# Altium project WordClockLedBoard.PrjPcb
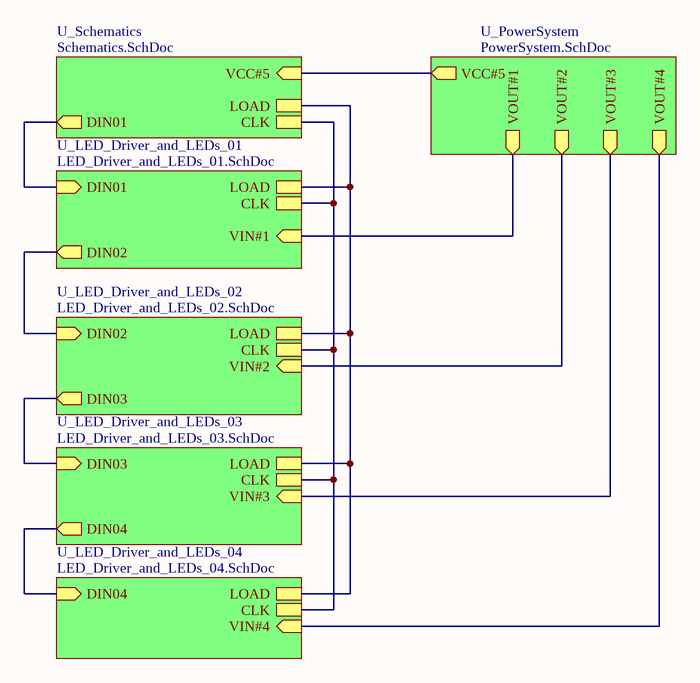
[diagram p0: MasterSheet.SchDoc]
4 sheets, 204 parts. Net scope: hierarchical (ports join the sheet entries above them; power ports are global).
Board file: NonRGB-v1.PcbDoc
Sheets:
  MasterSheet.SchDoc
    U_LED_Driver_and_LEDs_01 = LED_Driver_and_LEDs_01.SchDoc
    U_LED_Driver_and_LEDs_02 = LED_Driver_and_LEDs_02.SchDoc
    U_LED_Driver_and_LEDs_04 = LED_Driver_and_LEDs_04.SchDoc

## Sheet MasterSheet.SchDoc
size A

### Sub-sheets
U_LED_Driver_and_LEDs_01 = LED_Driver_and_LEDs_01.SchDoc: VIN#1 (in), DIN02 (out), DIN01 (in), LOAD, CLK
U_LED_Driver_and_LEDs_02 = LED_Driver_and_LEDs_02.SchDoc: VIN#2 (in), DIN02 (in), DIN03 (out), LOAD, CLK
U_LED_Driver_and_LEDs_03 = LED_Driver_and_LEDs_03.SchDoc (file not in this document): VIN#3 (in), DIN03 (in), DIN04 (out), LOAD, CLK
U_LED_Driver_and_LEDs_04 = LED_Driver_and_LEDs_04.SchDoc: VIN#4 (in), DIN04 (in), LOAD, CLK
U_PowerSystem = PowerSystem.SchDoc (file not in this document): VOUT#2 (out), VOUT#3 (out), VOUT#4 (out), VOUT#1 (out), VCC#5 (out)
U_Schematics = Schematics.SchDoc (file not in this document): DIN01 (out), VCC#5 (in), CLK, LOAD

### Nets
CLK: sheet U_LED_Driver_and_LEDs_01/CLK, sheet U_LED_Driver_and_LEDs_02/CLK, sheet U_LED_Driver_and_LEDs_03/CLK, sheet U_LED_Driver_and_LEDs_04/CLK, sheet U_Schematics/CLK
LOAD: sheet U_LED_Driver_and_LEDs_01/LOAD, sheet U_LED_Driver_and_LEDs_02/LOAD, sheet U_LED_Driver_and_LEDs_03/LOAD, sheet U_LED_Driver_and_LEDs_04/LOAD, sheet U_Schematics/LOAD
VCC#1: sheet U_PowerSystem/VOUT#1, sheet U_LED_Driver_and_LEDs_01/VIN#1
NetC15_1: sheet U_PowerSystem/VOUT#2, sheet U_LED_Driver_and_LEDs_02/VIN#2
NetC19_1: sheet U_PowerSystem/VOUT#4, sheet U_LED_Driver_and_LEDs_04/VIN#4
NetMAX1_1: sheet U_LED_Driver_and_LEDs_01/DIN01, sheet U_Schematics/DIN01
NetMAX1_24: sheet U_LED_Driver_and_LEDs_01/DIN02, sheet U_LED_Driver_and_LEDs_02/DIN02
NetMAX2_24: sheet U_LED_Driver_and_LEDs_02/DIN03, sheet U_LED_Driver_and_LEDs_03/DIN03
NetMAX4_1: sheet U_LED_Driver_and_LEDs_03/DIN04, sheet U_LED_Driver_and_LEDs_04/DIN04
(unnamed): sheet U_PowerSystem/VOUT#3, sheet U_LED_Driver_and_LEDs_03/VIN#3
(unnamed): sheet U_PowerSystem/VCC#5, sheet U_Schematics/VCC#5

## Sheet LED_Driver_and_LEDs_01.SchDoc
size A
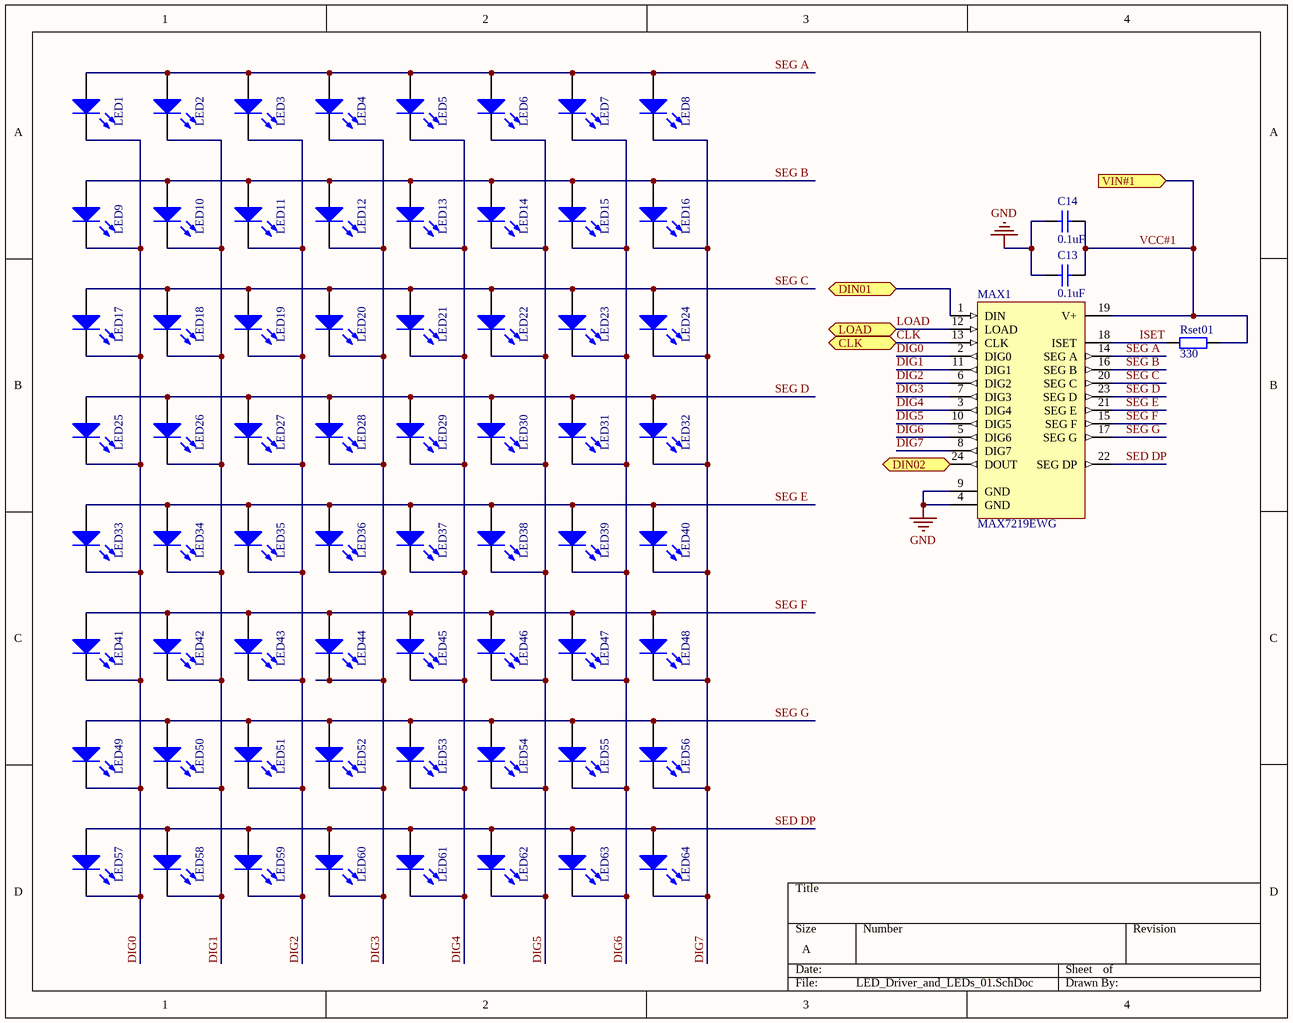
[diagram p1: LED_Driver_and_LEDs_01.SchDoc]

### Parts
C13  value 0.1uF  [6-0805_N]  (hidden comment: Cap Semi)
C14  value 0.1uF  [6-0805_N]  (hidden comment: Cap Semi)
LED1  LED3  [3.5X2.8X1.9]  (value not drawn)
LED2  LED3  [3.5X2.8X1.9]  (value not drawn)
LED3  LED3  [3.5X2.8X1.9]  (value not drawn)
LED4  LED3  [3.5X2.8X1.9]  (value not drawn)
LED5  LED3  [3.5X2.8X1.9]  (value not drawn)
LED6  LED3  [3.5X2.8X1.9]  (value not drawn)
LED7  LED3  [3.5X2.8X1.9]  (value not drawn)
LED8  LED3  [3.5X2.8X1.9]  (value not drawn)
LED9  LED3  [3.5X2.8X1.9]  (value not drawn)
LED10  LED3  [3.5X2.8X1.9]  (value not drawn)
LED11  LED3  [3.5X2.8X1.9]  (value not drawn)
LED12  LED3  [3.5X2.8X1.9]  (value not drawn)
LED13  LED3  [3.5X2.8X1.9]  (value not drawn)
LED14  LED3  [3.5X2.8X1.9]  (value not drawn)
LED15  LED3  [3.5X2.8X1.9]  (value not drawn)
LED16  LED3  [3.5X2.8X1.9]  (value not drawn)
LED17  LED3  [3.5X2.8X1.9]  (value not drawn)
LED18  LED3  [3.5X2.8X1.9]  (value not drawn)
LED19  LED3  [3.5X2.8X1.9]  (value not drawn)
LED20  LED3  [3.5X2.8X1.9]  (value not drawn)
LED21  LED3  [3.5X2.8X1.9]  (value not drawn)
LED22  LED3  [3.5X2.8X1.9]  (value not drawn)
LED23  LED3  [3.5X2.8X1.9]  (value not drawn)
LED24  LED3  [3.5X2.8X1.9]  (value not drawn)
LED25  LED3  [3.5X2.8X1.9]  (value not drawn)
LED26  LED3  [3.5X2.8X1.9]  (value not drawn)
LED27  LED3  [3.5X2.8X1.9]  (value not drawn)
LED28  LED3  [3.5X2.8X1.9]  (value not drawn)
LED29  LED3  [3.5X2.8X1.9]  (value not drawn)
LED30  LED3  [3.5X2.8X1.9]  (value not drawn)
LED31  LED3  [3.5X2.8X1.9]  (value not drawn)
LED32  LED3  [3.5X2.8X1.9]  (value not drawn)
LED33  LED3  [3.5X2.8X1.9]  (value not drawn)
LED34  LED3  [3.5X2.8X1.9]  (value not drawn)
LED35  LED3  [3.5X2.8X1.9]  (value not drawn)
LED36  LED3  [3.5X2.8X1.9]  (value not drawn)
LED37  LED3  [3.5X2.8X1.9]  (value not drawn)
LED38  LED3  [3.5X2.8X1.9]  (value not drawn)
LED39  LED3  [3.5X2.8X1.9]  (value not drawn)
LED40  LED3  [3.5X2.8X1.9]  (value not drawn)
LED41  LED3  [3.5X2.8X1.9]  (value not drawn)
LED42  LED3  [3.5X2.8X1.9]  (value not drawn)
LED43  LED3  [3.5X2.8X1.9]  (value not drawn)
LED44  LED3  [3.5X2.8X1.9]  (value not drawn)
LED45  LED3  [3.5X2.8X1.9]  (value not drawn)
LED46  LED3  [3.5X2.8X1.9]  (value not drawn)
LED47  LED3  [3.5X2.8X1.9]  (value not drawn)
LED48  LED3  [3.5X2.8X1.9]  (value not drawn)
LED49  LED3  [3.5X2.8X1.9]  (value not drawn)
LED50  LED3  [3.5X2.8X1.9]  (value not drawn)
LED51  LED3  [3.5X2.8X1.9]  (value not drawn)
LED52  LED3  [3.5X2.8X1.9]  (value not drawn)
LED53  LED3  [3.5X2.8X1.9]  (value not drawn)
LED54  LED3  [3.5X2.8X1.9]  (value not drawn)
LED55  LED3  [3.5X2.8X1.9]  (value not drawn)
LED56  LED3  [3.5X2.8X1.9]  (value not drawn)
LED57  LED3  [3.5X2.8X1.9]  (value not drawn)
LED58  LED3  [3.5X2.8X1.9]  (value not drawn)
LED59  LED3  [3.5X2.8X1.9]  (value not drawn)
LED60  LED3  [3.5X2.8X1.9]  (value not drawn)
LED61  LED3  [3.5X2.8X1.9]  (value not drawn)
LED62  LED3  [3.5X2.8X1.9]  (value not drawn)
LED63  LED3  [3.5X2.8X1.9]  (value not drawn)
LED64  LED3  [3.5X2.8X1.9]  (value not drawn)
MAX1  MAX7219EWG  [WSO24_N]
Rset01  value 330  [J1-0603]  (hidden comment: Res2)

### Ports
CLK (bidir), DIN01 (bidir), DIN02 (out), LOAD (bidir), VIN#1 (in)

### Nets
GND: C13.2 C14.2 MAX1.4(GND) MAX1.9(GND)
CLK: MAX1.13(CLK) ; port CLK
DIG0: LED1.2(K) LED9.2(K) LED17.2(K) LED25.2(K) LED33.2(K) LED41.2(K) LED49.2(K) LED57.2(K) MAX1.2(DIG0)
DIG1: LED2.2(K) LED10.2(K) LED18.2(K) LED26.2(K) LED34.2(K) LED42.2(K) LED50.2(K) LED58.2(K) MAX1.11(DIG1)
DIG2: LED3.2(K) LED11.2(K) LED19.2(K) LED27.2(K) LED35.2(K) LED43.2(K) LED51.2(K) LED59.2(K) MAX1.6(DIG2)
DIG3: LED4.2(K) LED12.2(K) LED20.2(K) LED28.2(K) LED36.2(K) LED44.2(K) LED52.2(K) LED60.2(K) MAX1.7(DIG3)
DIG4: LED5.2(K) LED13.2(K) LED21.2(K) LED29.2(K) LED37.2(K) LED45.2(K) LED53.2(K) LED61.2(K) MAX1.3(DIG4)
DIG5: LED6.2(K) LED14.2(K) LED22.2(K) LED30.2(K) LED38.2(K) LED46.2(K) LED54.2(K) LED62.2(K) MAX1.10(DIG5)
DIG6: LED7.2(K) LED15.2(K) LED23.2(K) LED31.2(K) LED39.2(K) LED47.2(K) LED55.2(K) LED63.2(K) MAX1.5(DIG6)
DIG7: LED8.2(K) LED16.2(K) LED24.2(K) LED32.2(K) LED40.2(K) LED48.2(K) LED56.2(K) LED64.2(K) MAX1.8(DIG7)
ISET: MAX1.18(ISET) Rset01.2
LOAD: MAX1.12(LOAD) ; port LOAD
SED DP: LED57.1(A) LED58.1(A) LED59.1(A) LED60.1(A) LED61.1(A) LED62.1(A) LED63.1(A) LED64.1(A) MAX1.22(SEG_DP)
SEG A: LED1.1(A) LED2.1(A) LED3.1(A) LED4.1(A) LED5.1(A) LED6.1(A) LED7.1(A) LED8.1(A) MAX1.14(SEG_A)
SEG B: LED9.1(A) LED10.1(A) LED11.1(A) LED12.1(A) LED13.1(A) LED14.1(A) LED15.1(A) LED16.1(A) MAX1.16(SEG_B)
SEG C: LED17.1(A) LED18.1(A) LED19.1(A) LED20.1(A) LED21.1(A) LED22.1(A) LED23.1(A) LED24.1(A) MAX1.20(SEG_C)
SEG D: LED25.1(A) LED26.1(A) LED27.1(A) LED28.1(A) LED29.1(A) LED30.1(A) LED31.1(A) LED32.1(A) MAX1.23(SEG_D)
SEG E: LED33.1(A) LED34.1(A) LED35.1(A) LED36.1(A) LED37.1(A) LED38.1(A) LED39.1(A) LED40.1(A) MAX1.21(SEG_E)
SEG F: LED41.1(A) LED42.1(A) LED43.1(A) LED44.1(A) LED45.1(A) LED46.1(A) LED47.1(A) LED48.1(A) MAX1.15(SEG_F)
SEG G: LED49.1(A) LED50.1(A) LED51.1(A) LED52.1(A) LED53.1(A) LED54.1(A) LED55.1(A) LED56.1(A) MAX1.17(SEG_G)
VCC#1: C13.1 C14.1 MAX1.19(V+) Rset01.1 ; port VIN#1
NetMAX1_1: MAX1.1(DIN) ; port DIN01
NetMAX1_24: MAX1.24(DOUT) ; port DIN02

### Library data of the parts
C13 C14 = Cap Semi: Capacitor (Semiconductor SIM Model); Published: 8-Jun-2000; LatestRevisionDate: 29-May-2009; LatestRevisionNote: IPC-7351 Footprint Added.; PackageReference: C1206; Publisher: Altium Limited; PackageDescription: Chip Capacitor
LED1-LED64 = LED3: Typical BLUE SiC LED; Published: 8-Jun-2000; LatestRevisionDate: 17-Dec-2003; LatestRevisionNote: PCB Footprint replaced.; DatasheetVersion: 16-Apr-2002; PackageVersion: 16-Apr-2002; PackageReference: 3.5X2.8X1.9; Publisher: Altium Limited; PackageDescription: SM LED; 2 C-Bend Leads; Body 3.5 x 2.8 x 1.9 mm, inc leads (LxWxH typ)
MAX1 = MAX7219EWG: Serially Interfaced, 8-Digit LED Display Driver; Published: 16-Jan-2001; LatestRevisionDate: 13-Apr-2006; LatestRevisionNote: IPC-7351 Footprint Added.; DatasheetVersion: Jul-1997; PackageReference: WSO24; Publisher: Altium Limited; PackageDescription: 24-Pin Small Outline Integrated Circuit 1.27 mm Pitch; ComponentLink1Description: Manufacturer Link; ComponentLink1URL: http://www.maxim-ic.com/; ComponentLink2Description: Datasheet; ComponentLink2URL: http://pdfserv.maxim-ic.com/en/ds/MAX7219-MAX7221.pdf
Rset01 = Res2: Resistor; Published: 8-Jun-2000; LatestRevisionDate: 17-Jul-2002; LatestRevisionNote: Re-released for DXP Platform.; PackageReference: AXIAL-0.4; Publisher: Altium Limited; PackageDescription: Axial Device, Thru-Hole; 2 Leads; 0.4 in Pin Spacing

## Sheet LED_Driver_and_LEDs_02.SchDoc
size A
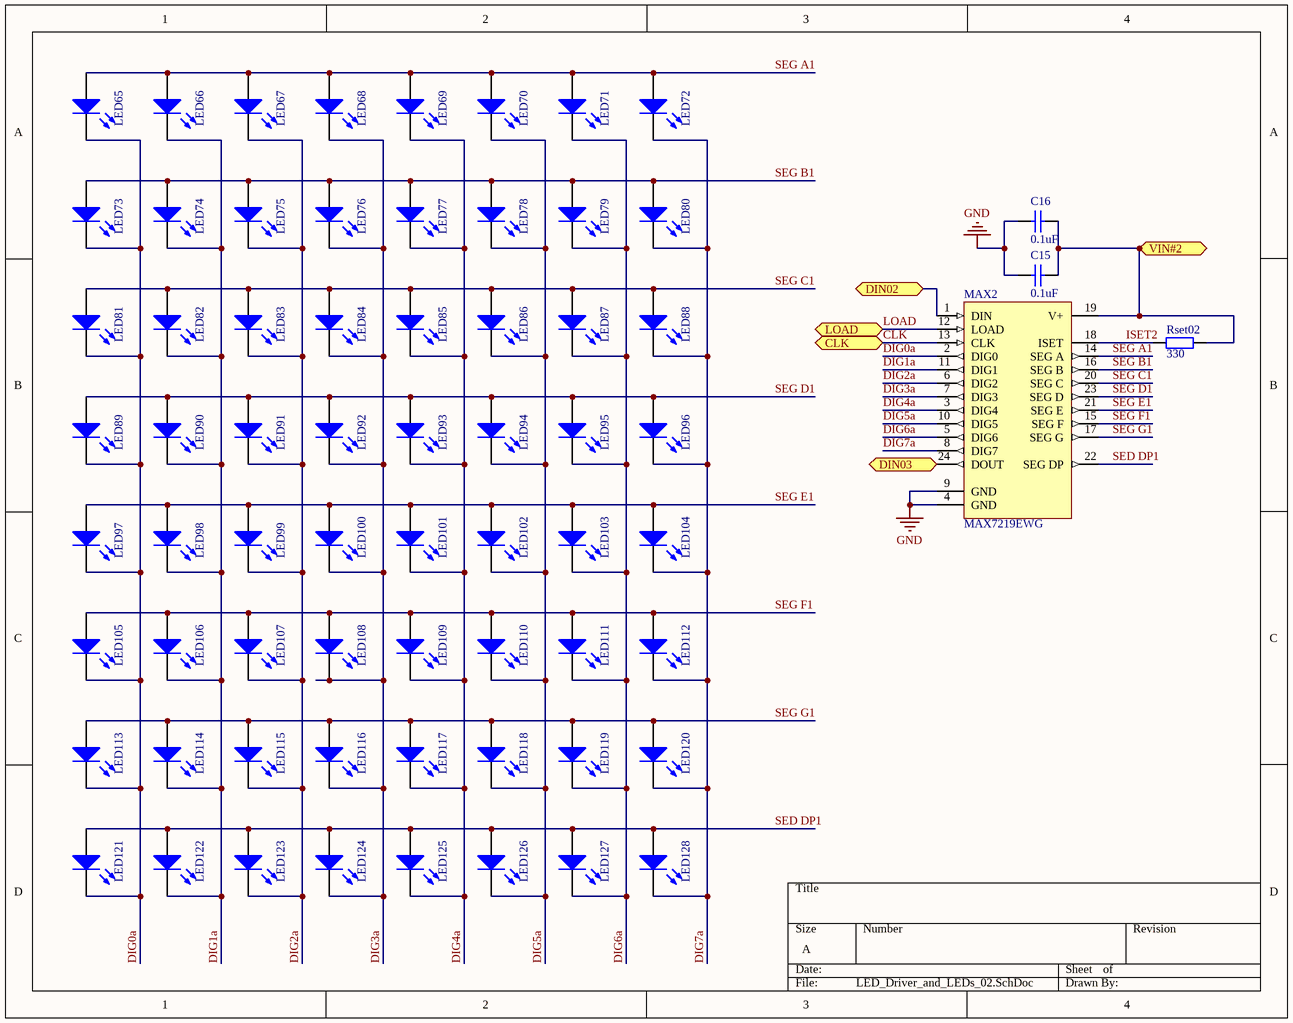
[diagram p2: LED_Driver_and_LEDs_02.SchDoc]

### Parts
C15  value 0.1uF  [6-0805_N]  (hidden comment: Cap Semi)
C16  value 0.1uF  [6-0805_N]  (hidden comment: Cap Semi)
LED65  LED3  [3.5X2.8X1.9]  (value not drawn)
LED66  LED3  [3.5X2.8X1.9]  (value not drawn)
LED67  LED3  [3.5X2.8X1.9]  (value not drawn)
LED68  LED3  [3.5X2.8X1.9]  (value not drawn)
LED69  LED3  [3.5X2.8X1.9]  (value not drawn)
LED70  LED3  [3.5X2.8X1.9]  (value not drawn)
LED71  LED3  [3.5X2.8X1.9]  (value not drawn)
LED72  LED3  [3.5X2.8X1.9]  (value not drawn)
LED73  LED3  [3.5X2.8X1.9]  (value not drawn)
LED74  LED3  [3.5X2.8X1.9]  (value not drawn)
LED75  LED3  [3.5X2.8X1.9]  (value not drawn)
LED76  LED3  [3.5X2.8X1.9]  (value not drawn)
LED77  LED3  [3.5X2.8X1.9]  (value not drawn)
LED78  LED3  [3.5X2.8X1.9]  (value not drawn)
LED79  LED3  [3.5X2.8X1.9]  (value not drawn)
LED80  LED3  [3.5X2.8X1.9]  (value not drawn)
LED81  LED3  [3.5X2.8X1.9]  (value not drawn)
LED82  LED3  [3.5X2.8X1.9]  (value not drawn)
LED83  LED3  [3.5X2.8X1.9]  (value not drawn)
LED84  LED3  [3.5X2.8X1.9]  (value not drawn)
LED85  LED3  [3.5X2.8X1.9]  (value not drawn)
LED86  LED3  [3.5X2.8X1.9]  (value not drawn)
LED87  LED3  [3.5X2.8X1.9]  (value not drawn)
LED88  LED3  [3.5X2.8X1.9]  (value not drawn)
LED89  LED3  [3.5X2.8X1.9]  (value not drawn)
LED90  LED3  [3.5X2.8X1.9]  (value not drawn)
LED91  LED3  [3.5X2.8X1.9]  (value not drawn)
LED92  LED3  [3.5X2.8X1.9]  (value not drawn)
LED93  LED3  [3.5X2.8X1.9]  (value not drawn)
LED94  LED3  [3.5X2.8X1.9]  (value not drawn)
LED95  LED3  [3.5X2.8X1.9]  (value not drawn)
LED96  LED3  [3.5X2.8X1.9]  (value not drawn)
LED97  LED3  [3.5X2.8X1.9]  (value not drawn)
LED98  LED3  [3.5X2.8X1.9]  (value not drawn)
LED99  LED3  [3.5X2.8X1.9]  (value not drawn)
LED100  LED3  [3.5X2.8X1.9]  (value not drawn)
LED101  LED3  [3.5X2.8X1.9]  (value not drawn)
LED102  LED3  [3.5X2.8X1.9]  (value not drawn)
LED103  LED3  [3.5X2.8X1.9]  (value not drawn)
LED104  LED3  [3.5X2.8X1.9]  (value not drawn)
LED105  LED3  [3.5X2.8X1.9]  (value not drawn)
LED106  LED3  [3.5X2.8X1.9]  (value not drawn)
LED107  LED3  [3.5X2.8X1.9]  (value not drawn)
LED108  LED3  [3.5X2.8X1.9]  (value not drawn)
LED109  LED3  [3.5X2.8X1.9]  (value not drawn)
LED110  LED3  [3.5X2.8X1.9]  (value not drawn)
LED111  LED3  [3.5X2.8X1.9]  (value not drawn)
LED112  LED3  [3.5X2.8X1.9]  (value not drawn)
LED113  LED3  [3.5X2.8X1.9]  (value not drawn)
LED114  LED3  [3.5X2.8X1.9]  (value not drawn)
LED115  LED3  [3.5X2.8X1.9]  (value not drawn)
LED116  LED3  [3.5X2.8X1.9]  (value not drawn)
LED117  LED3  [3.5X2.8X1.9]  (value not drawn)
LED118  LED3  [3.5X2.8X1.9]  (value not drawn)
LED119  LED3  [3.5X2.8X1.9]  (value not drawn)
LED120  LED3  [3.5X2.8X1.9]  (value not drawn)
LED121  LED3  [3.5X2.8X1.9]  (value not drawn)
LED122  LED3  [3.5X2.8X1.9]  (value not drawn)
LED123  LED3  [3.5X2.8X1.9]  (value not drawn)
LED124  LED3  [3.5X2.8X1.9]  (value not drawn)
LED125  LED3  [3.5X2.8X1.9]  (value not drawn)
LED126  LED3  [3.5X2.8X1.9]  (value not drawn)
LED127  LED3  [3.5X2.8X1.9]  (value not drawn)
LED128  LED3  [3.5X2.8X1.9]  (value not drawn)
MAX2  MAX7219EWG  [WSO24_N]
Rset02  value 330  [J1-0603]  (hidden comment: Res2)

### Ports
CLK (bidir), DIN02 (bidir), DIN03 (out), LOAD (bidir), VIN#2 (in)

### Nets
GND: C15.2 C16.2 MAX2.4(GND) MAX2.9(GND)
CLK: MAX2.13(CLK) ; port CLK
DIG0a: LED65.2(K) LED73.2(K) LED81.2(K) LED89.2(K) LED97.2(K) LED105.2(K) LED113.2(K) LED121.2(K) MAX2.2(DIG0)
DIG1a: LED66.2(K) LED74.2(K) LED82.2(K) LED90.2(K) LED98.2(K) LED106.2(K) LED114.2(K) LED122.2(K) MAX2.11(DIG1)
DIG2a: LED67.2(K) LED75.2(K) LED83.2(K) LED91.2(K) LED99.2(K) LED107.2(K) LED115.2(K) LED123.2(K) MAX2.6(DIG2)
DIG3a: LED68.2(K) LED76.2(K) LED84.2(K) LED92.2(K) LED100.2(K) LED108.2(K) LED116.2(K) LED124.2(K) MAX2.7(DIG3)
DIG4a: LED69.2(K) LED77.2(K) LED85.2(K) LED93.2(K) LED101.2(K) LED109.2(K) LED117.2(K) LED125.2(K) MAX2.3(DIG4)
DIG5a: LED70.2(K) LED78.2(K) LED86.2(K) LED94.2(K) LED102.2(K) LED110.2(K) LED118.2(K) LED126.2(K) MAX2.10(DIG5)
DIG6a: LED71.2(K) LED79.2(K) LED87.2(K) LED95.2(K) LED103.2(K) LED111.2(K) LED119.2(K) LED127.2(K) MAX2.5(DIG6)
DIG7a: LED72.2(K) LED80.2(K) LED88.2(K) LED96.2(K) LED104.2(K) LED112.2(K) LED120.2(K) LED128.2(K) MAX2.8(DIG7)
ISET2: MAX2.18(ISET) Rset02.2
LOAD: MAX2.12(LOAD) ; port LOAD
SED DP1: LED121.1(A) LED122.1(A) LED123.1(A) LED124.1(A) LED125.1(A) LED126.1(A) LED127.1(A) LED128.1(A) MAX2.22(SEG_DP)
SEG A1: LED65.1(A) LED66.1(A) LED67.1(A) LED68.1(A) LED69.1(A) LED70.1(A) LED71.1(A) LED72.1(A) MAX2.14(SEG_A)
SEG B1: LED73.1(A) LED74.1(A) LED75.1(A) LED76.1(A) LED77.1(A) LED78.1(A) LED79.1(A) LED80.1(A) MAX2.16(SEG_B)
SEG C1: LED81.1(A) LED82.1(A) LED83.1(A) LED84.1(A) LED85.1(A) LED86.1(A) LED87.1(A) LED88.1(A) MAX2.20(SEG_C)
SEG D1: LED89.1(A) LED90.1(A) LED91.1(A) LED92.1(A) LED93.1(A) LED94.1(A) LED95.1(A) LED96.1(A) MAX2.23(SEG_D)
SEG E1: LED97.1(A) LED98.1(A) LED99.1(A) LED100.1(A) LED101.1(A) LED102.1(A) LED103.1(A) LED104.1(A) MAX2.21(SEG_E)
SEG F1: LED105.1(A) LED106.1(A) LED107.1(A) LED108.1(A) LED109.1(A) LED110.1(A) LED111.1(A) LED112.1(A) MAX2.15(SEG_F)
SEG G1: LED113.1(A) LED114.1(A) LED115.1(A) LED116.1(A) LED117.1(A) LED118.1(A) LED119.1(A) LED120.1(A) MAX2.17(SEG_G)
NetC15_1: C15.1 C16.1 MAX2.19(V+) Rset02.1 ; port VIN#2
NetMAX1_24: MAX2.1(DIN) ; port DIN02
NetMAX2_24: MAX2.24(DOUT) ; port DIN03

### Library data of the parts
C15 C16 = Cap Semi: Capacitor (Semiconductor SIM Model); Published: 8-Jun-2000; LatestRevisionDate: 29-May-2009; LatestRevisionNote: IPC-7351 Footprint Added.; PackageReference: C1206; Publisher: Altium Limited; PackageDescription: Chip Capacitor
LED65-LED128 = LED3: Typical BLUE SiC LED; Published: 8-Jun-2000; LatestRevisionDate: 17-Dec-2003; LatestRevisionNote: PCB Footprint replaced.; DatasheetVersion: 16-Apr-2002; PackageVersion: 16-Apr-2002; PackageReference: 3.5X2.8X1.9; Publisher: Altium Limited; PackageDescription: SM LED; 2 C-Bend Leads; Body 3.5 x 2.8 x 1.9 mm, inc leads (LxWxH typ)
MAX2 = MAX7219EWG: as MAX1 on sheet LED_Driver_and_LEDs_01; Published: 16-Jan-2001; LatestRevisionDate: 13-Apr-2006; LatestRevisionNote: IPC-7351 Footprint Added.; DatasheetVersion: Jul-1997; PackageReference: WSO24; Publisher: Altium Limited; PackageDescription: 24-Pin Small Outline Integrated Circuit 1.27 mm Pitch; ComponentLink1Description: Manufacturer Link; ComponentLink1URL: http://www.maxim-ic.com/; ComponentLink2Description: Datasheet; ComponentLink2URL: http://pdfserv.maxim-ic.com/en/ds/MAX7219-MAX7221.pdf
Rset02 = Res2: Resistor; Published: 8-Jun-2000; LatestRevisionDate: 17-Jul-2002; LatestRevisionNote: Re-released for DXP Platform.; PackageReference: AXIAL-0.4; Publisher: Altium Limited; PackageDescription: Axial Device, Thru-Hole; 2 Leads; 0.4 in Pin Spacing

## Sheet LED_Driver_and_LEDs_04.SchDoc
size A
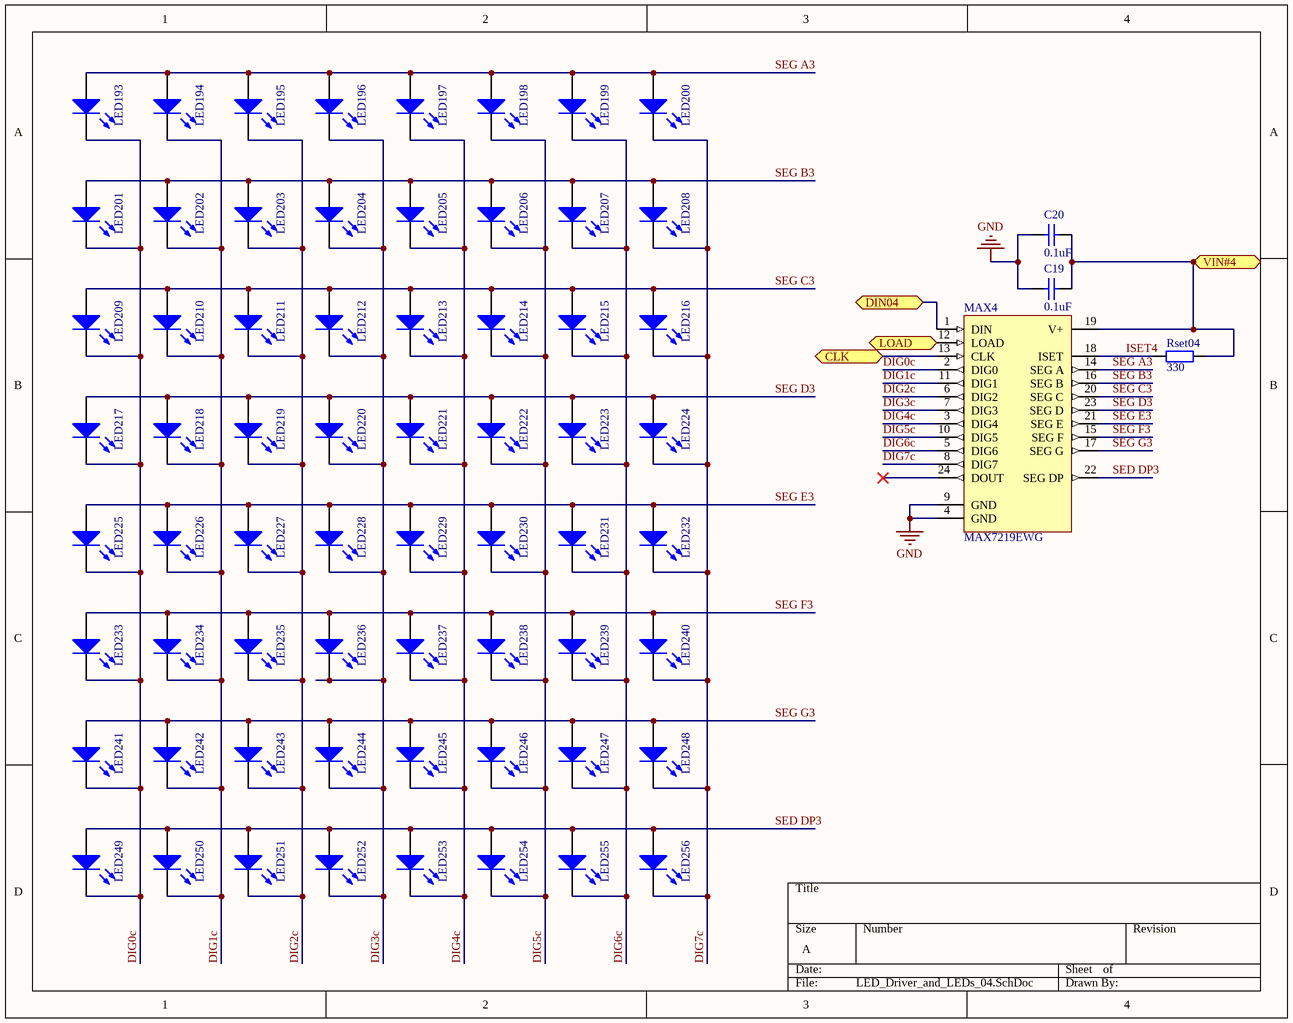
[diagram p3: LED_Driver_and_LEDs_04.SchDoc]

### Parts
C19  value 0.1uF  [6-0805_N]  (hidden comment: Cap Semi)
C20  value 0.1uF  [6-0805_N]  (hidden comment: Cap Semi)
LED193  LED3  [3.5X2.8X1.9]  (value not drawn)
LED194  LED3  [3.5X2.8X1.9]  (value not drawn)
LED195  LED3  [3.5X2.8X1.9]  (value not drawn)
LED196  LED3  [3.5X2.8X1.9]  (value not drawn)
LED197  LED3  [3.5X2.8X1.9]  (value not drawn)
LED198  LED3  [3.5X2.8X1.9]  (value not drawn)
LED199  LED3  [3.5X2.8X1.9]  (value not drawn)
LED200  LED3  [3.5X2.8X1.9]  (value not drawn)
LED201  LED3  [3.5X2.8X1.9]  (value not drawn)
LED202  LED3  [3.5X2.8X1.9]  (value not drawn)
LED203  LED3  [3.5X2.8X1.9]  (value not drawn)
LED204  LED3  [3.5X2.8X1.9]  (value not drawn)
LED205  LED3  [3.5X2.8X1.9]  (value not drawn)
LED206  LED3  [3.5X2.8X1.9]  (value not drawn)
LED207  LED3  [3.5X2.8X1.9]  (value not drawn)
LED208  LED3  [3.5X2.8X1.9]  (value not drawn)
LED209  LED3  [3.5X2.8X1.9]  (value not drawn)
LED210  LED3  [3.5X2.8X1.9]  (value not drawn)
LED211  LED3  [3.5X2.8X1.9]  (value not drawn)
LED212  LED3  [3.5X2.8X1.9]  (value not drawn)
LED213  LED3  [3.5X2.8X1.9]  (value not drawn)
LED214  LED3  [3.5X2.8X1.9]  (value not drawn)
LED215  LED3  [3.5X2.8X1.9]  (value not drawn)
LED216  LED3  [3.5X2.8X1.9]  (value not drawn)
LED217  LED3  [3.5X2.8X1.9]  (value not drawn)
LED218  LED3  [3.5X2.8X1.9]  (value not drawn)
LED219  LED3  [3.5X2.8X1.9]  (value not drawn)
LED220  LED3  [3.5X2.8X1.9]  (value not drawn)
LED221  LED3  [3.5X2.8X1.9]  (value not drawn)
LED222  LED3  [3.5X2.8X1.9]  (value not drawn)
LED223  LED3  [3.5X2.8X1.9]  (value not drawn)
LED224  LED3  [3.5X2.8X1.9]  (value not drawn)
LED225  LED3  [3.5X2.8X1.9]  (value not drawn)
LED226  LED3  [3.5X2.8X1.9]  (value not drawn)
LED227  LED3  [3.5X2.8X1.9]  (value not drawn)
LED228  LED3  [3.5X2.8X1.9]  (value not drawn)
LED229  LED3  [3.5X2.8X1.9]  (value not drawn)
LED230  LED3  [3.5X2.8X1.9]  (value not drawn)
LED231  LED3  [3.5X2.8X1.9]  (value not drawn)
LED232  LED3  [3.5X2.8X1.9]  (value not drawn)
LED233  LED3  [3.5X2.8X1.9]  (value not drawn)
LED234  LED3  [3.5X2.8X1.9]  (value not drawn)
LED235  LED3  [3.5X2.8X1.9]  (value not drawn)
LED236  LED3  [3.5X2.8X1.9]  (value not drawn)
LED237  LED3  [3.5X2.8X1.9]  (value not drawn)
LED238  LED3  [3.5X2.8X1.9]  (value not drawn)
LED239  LED3  [3.5X2.8X1.9]  (value not drawn)
LED240  LED3  [3.5X2.8X1.9]  (value not drawn)
LED241  LED3  [3.5X2.8X1.9]  (value not drawn)
LED242  LED3  [3.5X2.8X1.9]  (value not drawn)
LED243  LED3  [3.5X2.8X1.9]  (value not drawn)
LED244  LED3  [3.5X2.8X1.9]  (value not drawn)
LED245  LED3  [3.5X2.8X1.9]  (value not drawn)
LED246  LED3  [3.5X2.8X1.9]  (value not drawn)
LED247  LED3  [3.5X2.8X1.9]  (value not drawn)
LED248  LED3  [3.5X2.8X1.9]  (value not drawn)
LED249  LED3  [3.5X2.8X1.9]  (value not drawn)
LED250  LED3  [3.5X2.8X1.9]  (value not drawn)
LED251  LED3  [3.5X2.8X1.9]  (value not drawn)
LED252  LED3  [3.5X2.8X1.9]  (value not drawn)
LED253  LED3  [3.5X2.8X1.9]  (value not drawn)
LED254  LED3  [3.5X2.8X1.9]  (value not drawn)
LED255  LED3  [3.5X2.8X1.9]  (value not drawn)
LED256  LED3  [3.5X2.8X1.9]  (value not drawn)
MAX4  MAX7219EWG  [WSO24_N]
Rset04  value 330  [J1-0603]  (hidden comment: Res2)

### Ports
CLK (bidir), DIN04 (bidir), LOAD (bidir), VIN#4 (in)

### Nets
GND: C19.2 C20.2 MAX4.4(GND) MAX4.9(GND)
CLK: MAX4.13(CLK) ; port CLK
DIG0c: LED193.2(K) LED201.2(K) LED209.2(K) LED217.2(K) LED225.2(K) LED233.2(K) LED241.2(K) LED249.2(K) MAX4.2(DIG0)
DIG1c: LED194.2(K) LED202.2(K) LED210.2(K) LED218.2(K) LED226.2(K) LED234.2(K) LED242.2(K) LED250.2(K) MAX4.11(DIG1)
DIG2c: LED195.2(K) LED203.2(K) LED211.2(K) LED219.2(K) LED227.2(K) LED235.2(K) LED243.2(K) LED251.2(K) MAX4.6(DIG2)
DIG3c: LED196.2(K) LED204.2(K) LED212.2(K) LED220.2(K) LED228.2(K) LED236.2(K) LED244.2(K) LED252.2(K) MAX4.7(DIG3)
DIG4c: LED197.2(K) LED205.2(K) LED213.2(K) LED221.2(K) LED229.2(K) LED237.2(K) LED245.2(K) LED253.2(K) MAX4.3(DIG4)
DIG5c: LED198.2(K) LED206.2(K) LED214.2(K) LED222.2(K) LED230.2(K) LED238.2(K) LED246.2(K) LED254.2(K) MAX4.10(DIG5)
DIG6c: LED199.2(K) LED207.2(K) LED215.2(K) LED223.2(K) LED231.2(K) LED239.2(K) LED247.2(K) LED255.2(K) MAX4.5(DIG6)
DIG7c: LED200.2(K) LED208.2(K) LED216.2(K) LED224.2(K) LED232.2(K) LED240.2(K) LED248.2(K) LED256.2(K) MAX4.8(DIG7)
ISET4: MAX4.18(ISET) Rset04.2
LOAD: MAX4.12(LOAD) ; port LOAD
SED DP3: LED249.1(A) LED250.1(A) LED251.1(A) LED252.1(A) LED253.1(A) LED254.1(A) LED255.1(A) LED256.1(A) MAX4.22(SEG_DP)
SEG A3: LED193.1(A) LED194.1(A) LED195.1(A) LED196.1(A) LED197.1(A) LED198.1(A) LED199.1(A) LED200.1(A) MAX4.14(SEG_A)
SEG B3: LED201.1(A) LED202.1(A) LED203.1(A) LED204.1(A) LED205.1(A) LED206.1(A) LED207.1(A) LED208.1(A) MAX4.16(SEG_B)
SEG C3: LED209.1(A) LED210.1(A) LED211.1(A) LED212.1(A) LED213.1(A) LED214.1(A) LED215.1(A) LED216.1(A) MAX4.20(SEG_C)
SEG D3: LED217.1(A) LED218.1(A) LED219.1(A) LED220.1(A) LED221.1(A) LED222.1(A) LED223.1(A) LED224.1(A) MAX4.23(SEG_D)
SEG E3: LED225.1(A) LED226.1(A) LED227.1(A) LED228.1(A) LED229.1(A) LED230.1(A) LED231.1(A) LED232.1(A) MAX4.21(SEG_E)
SEG F3: LED233.1(A) LED234.1(A) LED235.1(A) LED236.1(A) LED237.1(A) LED238.1(A) LED239.1(A) LED240.1(A) MAX4.15(SEG_F)
SEG G3: LED241.1(A) LED242.1(A) LED243.1(A) LED244.1(A) LED245.1(A) LED246.1(A) LED247.1(A) LED248.1(A) MAX4.17(SEG_G)
NetC19_1: C19.1 C20.1 MAX4.19(V+) Rset04.1 ; port VIN#4
NetMAX4_1: MAX4.1(DIN) ; port DIN04

Not connected (* = marked no-connect by the designer): MAX4 24(DOUT)*

### Library data of the parts
C19 C20 = Cap Semi: Capacitor (Semiconductor SIM Model); Published: 8-Jun-2000; LatestRevisionDate: 29-May-2009; LatestRevisionNote: IPC-7351 Footprint Added.; PackageReference: C1206; Publisher: Altium Limited; PackageDescription: Chip Capacitor
LED193-LED256 = LED3: Typical BLUE SiC LED; Published: 8-Jun-2000; LatestRevisionDate: 17-Dec-2003; LatestRevisionNote: PCB Footprint replaced.; DatasheetVersion: 16-Apr-2002; PackageVersion: 16-Apr-2002; PackageReference: 3.5X2.8X1.9; Publisher: Altium Limited; PackageDescription: SM LED; 2 C-Bend Leads; Body 3.5 x 2.8 x 1.9 mm, inc leads (LxWxH typ)
MAX4 = MAX7219EWG: as MAX1 on sheet LED_Driver_and_LEDs_01; Published: 16-Jan-2001; LatestRevisionDate: 13-Apr-2006; LatestRevisionNote: IPC-7351 Footprint Added.; DatasheetVersion: Jul-1997; PackageReference: WSO24; Publisher: Altium Limited; PackageDescription: 24-Pin Small Outline Integrated Circuit 1.27 mm Pitch; ComponentLink1Description: Manufacturer Link; ComponentLink1URL: http://www.maxim-ic.com/; ComponentLink2Description: Datasheet; ComponentLink2URL: http://pdfserv.maxim-ic.com/en/ds/MAX7219-MAX7221.pdf
Rset04 = Res2: Resistor; Published: 8-Jun-2000; LatestRevisionDate: 17-Jul-2002; LatestRevisionNote: Re-released for DXP Platform.; PackageReference: AXIAL-0.4; Publisher: Altium Limited; PackageDescription: Axial Device, Thru-Hole; 2 Leads; 0.4 in Pin Spacing

## Nets that join several sheets
GND: LED_Driver_and_LEDs_01 (C13.2 C14.2 MAX1.4 MAX1.9), LED_Driver_and_LEDs_02 (C15.2 C16.2 MAX2.4 MAX2.9), LED_Driver_and_LEDs_04 (C19.2 C20.2 MAX4.4 MAX4.9)
CLK: LED_Driver_and_LEDs_01 (MAX1.13), LED_Driver_and_LEDs_02 (MAX2.13), LED_Driver_and_LEDs_04 (MAX4.13)
LOAD: LED_Driver_and_LEDs_01 (MAX1.12), LED_Driver_and_LEDs_02 (MAX2.12), LED_Driver_and_LEDs_04 (MAX4.12)
NetMAX1_24: LED_Driver_and_LEDs_01 (MAX1.24), LED_Driver_and_LEDs_02 (MAX2.1)